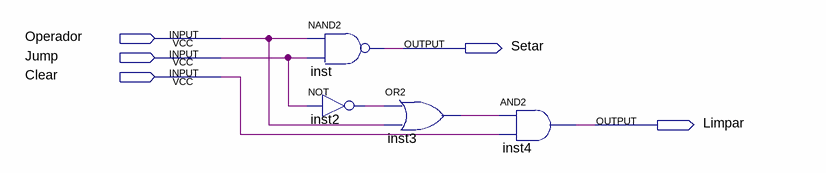
[diagram p0: schematic sheet]
// Quartus schematic pular.bdf as structural Verilog: 4 symbols, 5 pins
module pular (
  input  Operador,
  input  Jump,
  input  Clear,
  output Setar,
  output Limpar
);

  wire inst2_out, inst3_out;

  nand inst (Setar, Operador, Jump);
  not inst2 (inst2_out, Jump);
  or inst3 (inst3_out, inst2_out, Operador);
  and inst4 (Limpar, inst3_out, Clear);
endmodule
